# EAGLE schematic McCloud Schematic (EAGLE 8.6.2)
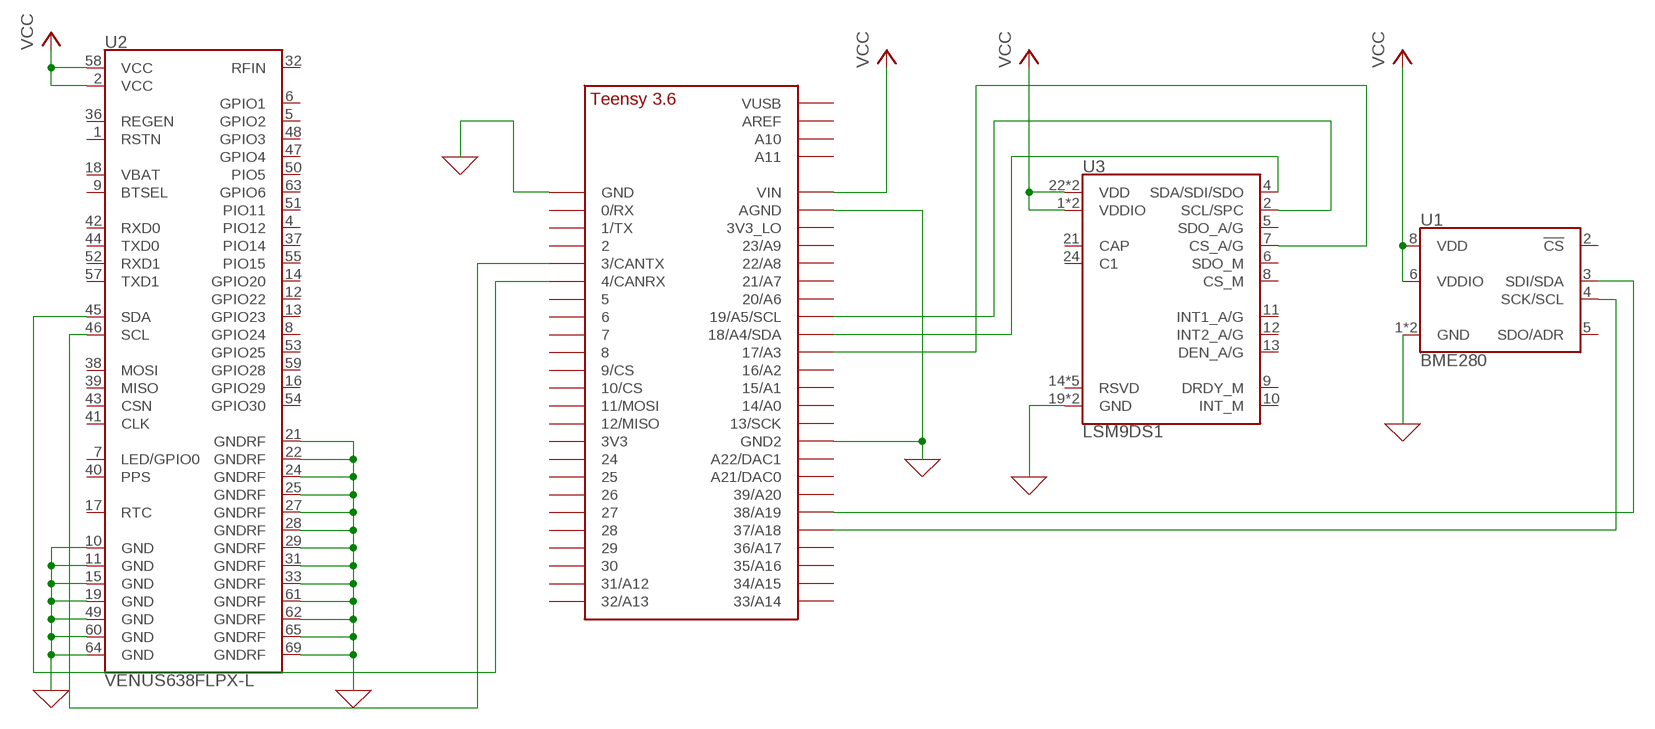
[diagram p0: schematic, sheet 1]

## Parts
U1  BME280  [LGA-8-2.5X2.5]
U2  VENUS638FLPX-L  [VENUS638FLPX]
U3  LSM9DS1  [LGA-24-3.5X3]
U$1  TEENSY_3.5/3.6_BASIC  [TEENSY_3.5/3.6_BASIC]

## Nets
0: U1.1(GND) U1.7(GND) U2.10(GND) U2.11(GND) U2.15(GND) U2.19(GND) U2.21(GNDRF) U2.22(GNDRF) U2.24(GNDRF) U2.25(GNDRF) U2.27(GNDRF) U2.28(GNDRF) U2.29(GNDRF) U2.31(GNDRF) U2.33(GNDRF) U2.49(GND) U2.60(GND) U2.61(GNDRF) U2.62(GNDRF) U2.64(GND) U2.65(GNDRF) U2.69(GNDRF) U3.19(GND) U3.20(GND) U$1.AGND U$1.GND U$1.GND2 ; supply symbol labelled GND
N$20: U3.2(SCL/SPC) U$1.19/A5/SCL
N$21: U3.4(SDA/SDI/SDO) U$1.18/A4/SDA
N$25: U3.7(CS_A/G) U$1.17/A3
N$26: U1.3(SDI/SDA) U$1.38/A19
N$27: U1.4(SCK/SCL) U$1.37/A18
N$31: U2.46(SCL) U$1.3/CANTX
N$32: U2.45(SDA) U$1.4/CANRX
VCC: U1.6(VDDIO) U1.8(VDD) U2.2(VCC) U2.58(VCC) U3.1(VDDIO) U3.3(VDDIO) U3.22(VDD) U3.23(VDD) U$1.VIN
Unconnected: U1.2(!CS) U1.5(SDO/ADR) U2.1(RSTN) U2.4(PIO12) U2.5(GPIO2) U2.6(GPIO1) U2.7(LED/GPIO0) U2.8(GPIO24) U2.9(BTSEL) U2.12(GPIO22) U2.13(GPIO23) U2.14(GPIO20) U2.16(GPIO29) U2.17(RTC) U2.18(VBAT) U2.32(RFIN) U2.36(REGEN) U2.37(PIO14) U2.38(MOSI) U2.39(MISO) U2.40(PPS) U2.41(CLK) U2.42(RXD0) U2.43(CSN) U2.44(TXD0) U2.47(GPIO4) U2.48(GPIO3) U2.50(PIO5) U2.51(PIO11) U2.52(RXD1) U2.53(GPIO25) U2.54(GPIO30) U2.55(PIO15) U2.57(TXD1) U2.59(GPIO28) U2.63(GPIO6) U3.5(SDO_A/G) U3.6(SDO_M) U3.8(CS_M) U3.9(DRDY_M) U3.10(INT_M) U3.11(INT1_A/G) U3.12(INT2_A/G) U3.13(DEN_A/G) U3.14(RSVD) U3.15(RSVD) U3.16(RSVD) U3.17(RSVD) U3.18(RSVD) U3.21(CAP) U3.24(C1) U$1.0/RX U$1.1/TX U$1.2 U$1.3V3 U$1.3V3_LO U$1.5 U$1.6 U$1.7 U$1.8 U$1.9/CS U$1.10/CS U$1.11/MOSI U$1.12/MISO U$1.13/SCK U$1.14/A0 U$1.15/A1 U$1.16/A2 U$1.20/A6 U$1.21/A7 U$1.21/DAC0(A21/DAC0) U$1.22/A8 U$1.23/A9 U$1.24 U$1.25 U$1.26 U$1.27 U$1.28 U$1.29 U$1.30 U$1.31/A12 U$1.32/A13 U$1.33/A14 U$1.34/A15 U$1.35/A16 U$1.36/A17 U$1.39/A20 U$1.A10 U$1.A11 U$1.A22/DAC1 U$1.AREF U$1.VUSB

## Library data of the parts
U1 = SparkFun-Sensors:BME280: Bosch BME280 – Combined Humidity and Pressure Sensor The BME280 is as combined digital humidity, pressure and temperature sensor based on proven sensing principles. The sensor module is housed in an extremely compact metal-lid LGA package with a footprint of only 2.5×2.5mm² with a height of 0.93mm. Its small dimensions and its low power consumption allow the implementation in battery driven devices such as handsets, GPS modules or watches. Datasheet <https://cdn.sparkfun.com/assets/learn_tutorials/4/1/9/BST-BME280_DS001-10.pdf> SparkFun Products SparkFun Atmospheric Sensor Breakout - BME280 <https://www.sparkfun.com/products/13676> (SEN-13676); PROD_ID: IC-13090
U2 = SparkFun-GPS:VENUS638FLPX-L: Venus638FLPX-L GPS Receiver Venus638FLPx is a high performance, low cost, single chip GPS receiver targeting mobile consumer and cellular handset applications. It offers very low power consumption, high sensitivity, and best in class signal acquisition and time-to-first-fix performance. Venus638FLPx contains all the necessary components of a complete GPS receiver, includes 1.2dB cascaded system NF RF front-end, GPS baseband signal processor, 0.5ppm TCXO, 32.768kHz RTC crystal, RTC LDO regulator, and passive components. It requires very low external component count and takes up only 100mm2 PCB footprint. Dedicated massive-correlator signal parameter search engine within the baseband enables rapid search of all the available satellites and acquisition of very weak signal. An advanced track engine allows weak signal tracking and positioning in harsh environments such as urban canyons and under deep foliage. The self-contained architecture keeps GPS processing off the host and allows integration into applications with very little resource. SparkFun Products GPS Module - Venus638FLPx-L 20Hz (14 Channel) <https://www.sparkfun.com/products/10919> (GPS-10919); PROD_ID: IC-10734
U3 = SparkFun-Sensors:LSM9DS1: ST Microelectronics LSM9DS1 9DOF IMU - Accelerometer, Gyroscope & Magnetometer The LSM9DS1 is a versatile, motion-sensing system-in-a-chip. It houses a 3-axis accelerometer, 3-axis gyroscope, and 3-axis magnetometer – nine degrees of freedom (9DOF) in a single IC! The LSM9DS1 is equipped with a digital interface, but even that is flexible: it supports both I2C and SPI, so you’ll be hard-pressed to find a microcontroller it doesn’t work with. Datasheet <https://cdn.sparkfun.com/assets/learn_tutorials/3/7/3/LSM9DS1_Datasheet.pdf> SparkFun Products SparkFun 9 Degrees of Freedom IMU Breakout - LSM9DS1 <https://www.sparkfun.com/products/13284> (SEN-13284) SparkFun Photon IMU Shield <https://www.sparkfun.com/products/13629> (DEV-13629); PROD_ID: IC-12536
U$1 = Teensy356:TEENSY_3.5/3.6_BASIC